# Altium schematic sheet Microcontroller_Module.SchDoc
size A2; SheetNumber: 1; SheetTotal: 3
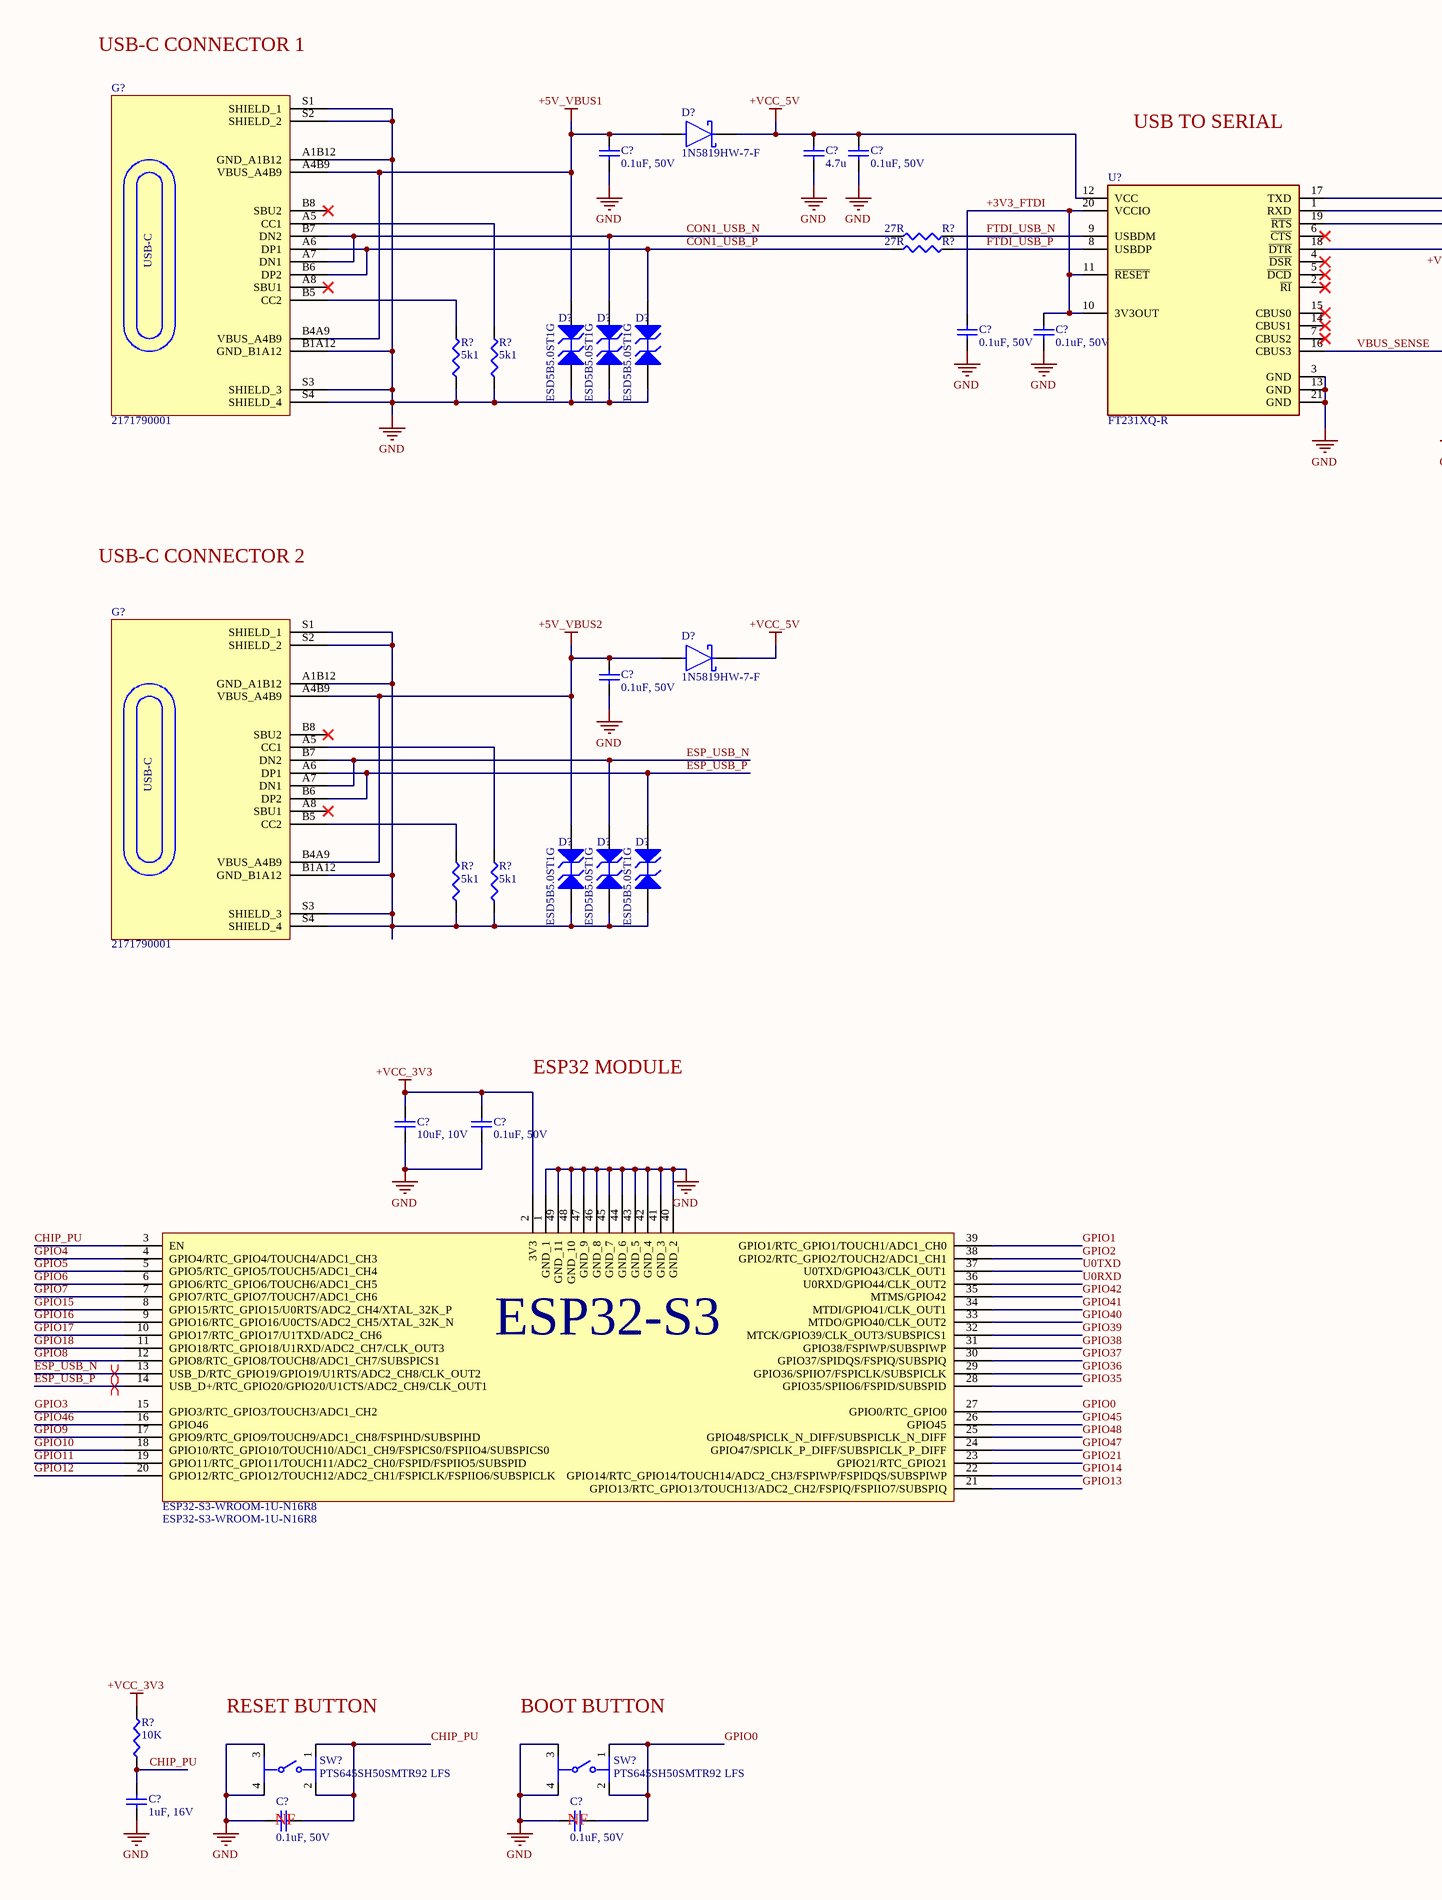
[diagram p0: Microcontroller_Module.SchDoc, left]
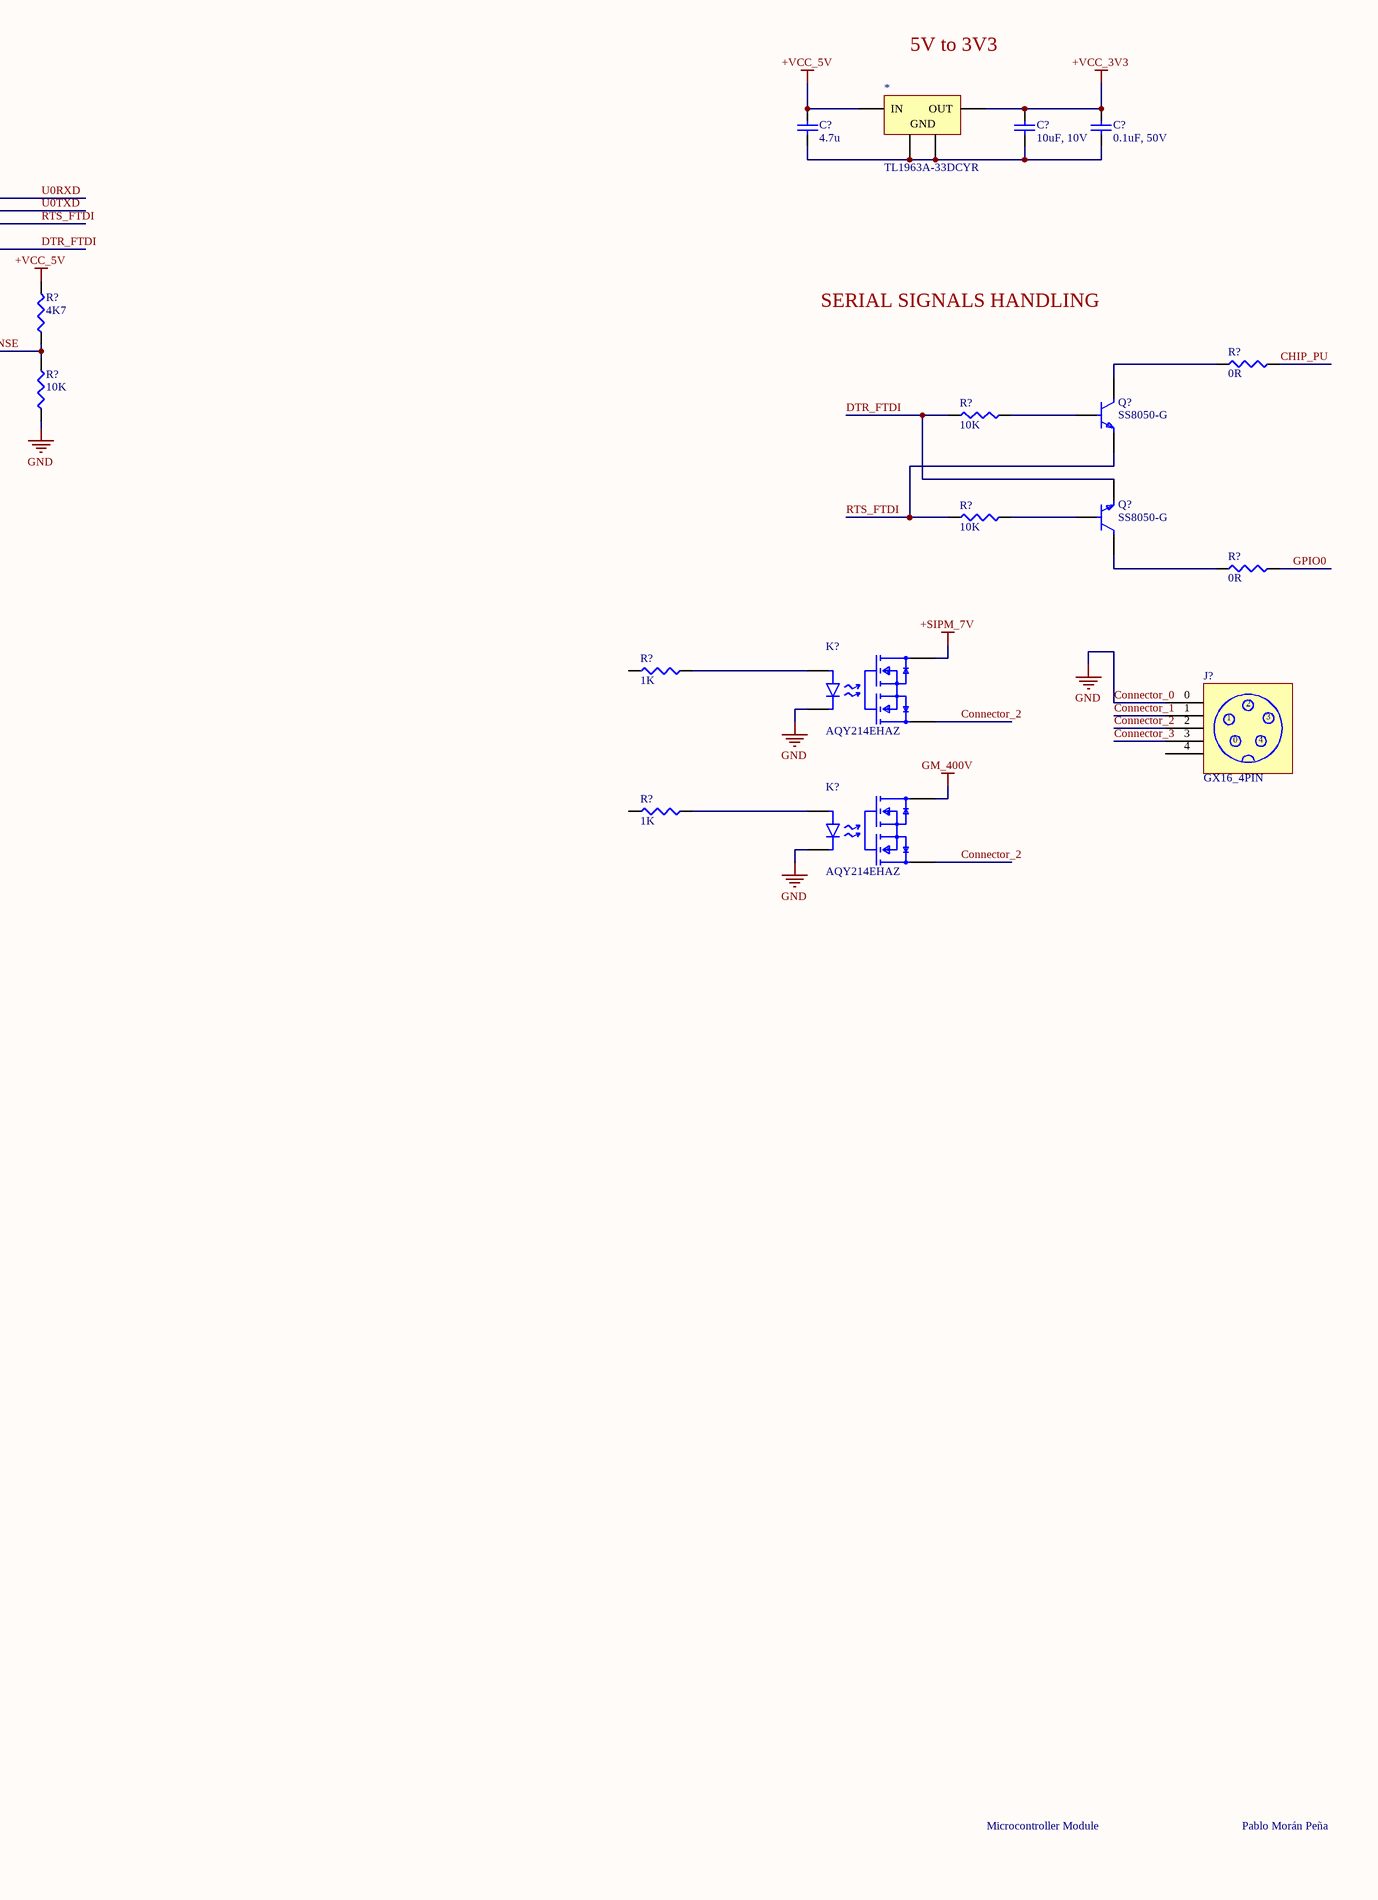
[diagram p1: Microcontroller_Module.SchDoc, right]

## Parts
(Parts that share a designator on the sheet are numbered #1, #2 ... from top to bottom, then left to right.)
*  TL1963A-33DCYR
C?#1  4.7u
C?#2  10uF, 10V
C?#3  0.1uF, 50V
C?#4  0.1uF, 50V
C?#5  4.7u
C?#6  0.1uF, 50V
C?#7  0.1uF, 50V
C?#8  0.1uF, 50V
C?#9  0.1uF, 50V
C?#10  10uF, 10V
C?#11  0.1uF, 50V
C?#12  1uF, 16V
C?#13  0.1uF, 50V
C?#14  0.1uF, 50V
D?#1  1N5819HW-7-F
D?#2  ESD5B5.0ST1G
D?#3  ESD5B5.0ST1G
D?#4  ESD5B5.0ST1G
D?#5  1N5819HW-7-F
D?#6  ESD5B5.0ST1G
D?#7  ESD5B5.0ST1G
D?#8  ESD5B5.0ST1G
ESP32-S3-WROOM-1U-N16R8  ESP32-S3-WROOM-1U-N16R8
G?#1  2171790001
G?#2  2171790001
J?  GX16_4PIN
K?#1  AQY214EHAZ
K?#2  AQY214EHAZ
Q?#1  SS8050-G
Q?#2  SS8050-G
R?#1  27R
R?#2  27R
R?#3  4K7
R?#4  0R
R?#5  5k1
R?#6  5k1
R?#7  10K
R?#8  10K
R?#9  10K
R?#10  0R
R?#11  1K
R?#12  1K
R?#13  5k1
R?#14  5k1
R?#15  10K
SW?#1  PTS645SH50SMTR92 LFS
SW?#2  PTS645SH50SMTR92 LFS
U?  FT231XQ-R

## Nets
+5V_VBUS1: C?#4.2 D?#1.2(A) D?#2.2(A2) G?#1.A4B9(VBUS_A4B9) G?#1.B4A9(VBUS_A4B9)
+5V_VBUS2: C?#9.2 D?#5.2(A) D?#6.2(A2) G?#2.A4B9(VBUS_A4B9) G?#2.B4A9(VBUS_A4B9)
+SIPM_7V: K?#1.4(2_DRAIN)
+VCC_3V3: *.3(OUT) C?#2.2 C?#3.2 C?#10.2 C?#11.2 ESP32-S3-WROOM-1U-N16R8.2(3V3) R?#15.2
+VCC_5V: *.1(IN) C?#1.2 C?#5.2 C?#6.2 D?#1.1(C) D?#5.1(C) R?#3.2 U?.12(VCC)
Connector_0: C?#4.1 C?#5.1 C?#6.1 C?#7.1 C?#8.1 C?#9.1 C?#10.1 C?#11.1 C?#12.1 C?#13.1 C?#14.1 D?#2.1(A1) D?#3.1(A1) D?#4.1(A1) ESP32-S3-WROOM-1U-N16R8.1(GND_1) ESP32-S3-WROOM-1U-N16R8.40(GND_2) ESP32-S3-WROOM-1U-N16R8.41(GND_3) ESP32-S3-WROOM-1U-N16R8.42(GND_4) ESP32-S3-WROOM-1U-N16R8.43(GND_5) ESP32-S3-WROOM-1U-N16R8.44(GND_6) ESP32-S3-WROOM-1U-N16R8.45(GND_7) ESP32-S3-WROOM-1U-N16R8.46(GND_8) ESP32-S3-WROOM-1U-N16R8.47(GND_9) ESP32-S3-WROOM-1U-N16R8.48(GND_10) ESP32-S3-WROOM-1U-N16R8.49(GND_11) G?#1.A1B12(GND_A1B12) G?#1.B1A12(GND_B1A12) G?#1.S1(SHIELD_1) G?#1.S2(SHIELD_2) G?#1.S3(SHIELD_3) G?#1.S4(SHIELD_4) J?.0 K?#1.2(C) K?#2.2(C) R?#5.1 R?#6.1 R?#8.1 SW?#1.3 SW?#1.4 SW?#2.3 SW?#2.4 U?.3(GND) U?.13(GND) U?.21(GND)  [also labelled GND]
GM_400V: K?#2.4(2_DRAIN)
+3V3_FTDI: C?#7.2 C?#8.2 U?.10(3V3OUT) U?.11(~{RESET}) U?.20(VCCIO)
CHIP_PU: C?#12.2 C?#13.2 ESP32-S3-WROOM-1U-N16R8.3(EN) R?#4.2 R?#15.1 SW?#1.1 SW?#1.2
CON1_USB_N: D?#3.2(A2) G?#1.A7(DN1) G?#1.B7(DN2) R?#1.1
CON1_USB_P: D?#4.2(A2) G?#1.A6(DP1) G?#1.B6(DP2) R?#2.1
Connector_1: J?.1
Connector_2: J?.2 K?#1.3(1_DRAIN) K?#2.3(1_DRAIN)
Connector_3: J?.3
DTR_FTDI: Q?#2.2(E) R?#7.1 U?.18(~{DTR})
ESP_USB_N: D?#7.2(A2) ESP32-S3-WROOM-1U-N16R8.13(USB_D/RTC_GPIO19/GPIO19/U1RTS/ADC2_CH8/CLK_OUT2) G?#2.A7(DN1) G?#2.B7(DN2)
ESP_USB_P: D?#8.2(A2) ESP32-S3-WROOM-1U-N16R8.14(USB_D+/RTC_GPIO20/GPIO20/U1CTS/ADC2_CH9/CLK_OUT1) G?#2.A6(DP1) G?#2.B6(DP2)
FTDI_USB_N: R?#1.2 U?.9(USBDM)
FTDI_USB_P: R?#2.2 U?.8(USBDP)
GPIO0: C?#14.2 ESP32-S3-WROOM-1U-N16R8.27(GPIO0/RTC_GPIO0) R?#10.2 SW?#2.1 SW?#2.2
GPIO1: ESP32-S3-WROOM-1U-N16R8.39(GPIO1/RTC_GPIO1/TOUCH1/ADC1_CH0)
GPIO2: ESP32-S3-WROOM-1U-N16R8.38(GPIO2/RTC_GPIO2/TOUCH2/ADC1_CH1)
GPIO3: ESP32-S3-WROOM-1U-N16R8.15(GPIO3/RTC_GPIO3/TOUCH3/ADC1_CH2)
GPIO4: ESP32-S3-WROOM-1U-N16R8.4(GPIO4/RTC_GPIO4/TOUCH4/ADC1_CH3)
GPIO5: ESP32-S3-WROOM-1U-N16R8.5(GPIO5/RTC_GPIO5/TOUCH5/ADC1_CH4)
GPIO6: ESP32-S3-WROOM-1U-N16R8.6(GPIO6/RTC_GPIO6/TOUCH6/ADC1_CH5)
GPIO7: ESP32-S3-WROOM-1U-N16R8.7(GPIO7/RTC_GPIO7/TOUCH7/ADC1_CH6)
GPIO8: ESP32-S3-WROOM-1U-N16R8.12(GPIO8/RTC_GPIO8/TOUCH8/ADC1_CH7/SUBSPICS1)
GPIO9: ESP32-S3-WROOM-1U-N16R8.17(GPIO9/RTC_GPIO9/TOUCH9/ADC1_CH8/FSPIHD/SUBSPIHD)
GPIO10: ESP32-S3-WROOM-1U-N16R8.18(GPIO10/RTC_GPIO10/TOUCH10/ADC1_CH9/FSPICS0/FSPIIO4/SUBSPICS0)
GPIO11: ESP32-S3-WROOM-1U-N16R8.19(GPIO11/RTC_GPIO11/TOUCH11/ADC2_CH0/FSPID/FSPIIO5/SUBSPID)
GPIO12: ESP32-S3-WROOM-1U-N16R8.20(GPIO12/RTC_GPIO12/TOUCH12/ADC2_CH1/FSPICLK/FSPIIO6/SUBSPICLK)
GPIO13: ESP32-S3-WROOM-1U-N16R8.21(GPIO13/RTC_GPIO13/TOUCH13/ADC2_CH2/FSPIQ/FSPIIO7/SUBSPIQ)
GPIO14: ESP32-S3-WROOM-1U-N16R8.22(GPIO14/RTC_GPIO14/TOUCH14/ADC2_CH3/FSPIWP/FSPIDQS/SUBSPIWP)
GPIO15: ESP32-S3-WROOM-1U-N16R8.8(GPIO15/RTC_GPIO15/U0RTS/ADC2_CH4/XTAL_32K_P)
GPIO16: ESP32-S3-WROOM-1U-N16R8.9(GPIO16/RTC_GPIO16/U0CTS/ADC2_CH5/XTAL_32K_N)
GPIO17: ESP32-S3-WROOM-1U-N16R8.10(GPIO17/RTC_GPIO17/U1TXD/ADC2_CH6)
GPIO18: ESP32-S3-WROOM-1U-N16R8.11(GPIO18/RTC_GPIO18/U1RXD/ADC2_CH7/CLK_OUT3)
GPIO21: ESP32-S3-WROOM-1U-N16R8.23(GPIO21/RTC_GPIO21)
GPIO35: ESP32-S3-WROOM-1U-N16R8.28(GPIO35/SPIIO6/FSPID/SUBSPID)
GPIO36: ESP32-S3-WROOM-1U-N16R8.29(GPIO36/SPIIO7/FSPICLK/SUBSPICLK)
GPIO37: ESP32-S3-WROOM-1U-N16R8.30(GPIO37/SPIDQS/FSPIQ/SUBSPIQ)
GPIO38: ESP32-S3-WROOM-1U-N16R8.31(GPIO38/FSPIWP/SUBSPIWP)
GPIO39: ESP32-S3-WROOM-1U-N16R8.32(MTCK/GPIO39/CLK_OUT3/SUBSPICS1)
GPIO40: ESP32-S3-WROOM-1U-N16R8.33(MTDO/GPIO40/CLK_OUT2)
GPIO41: ESP32-S3-WROOM-1U-N16R8.34(MTDI/GPIO41/CLK_OUT1)
GPIO42: ESP32-S3-WROOM-1U-N16R8.35(MTMS/GPIO42)
GPIO45: ESP32-S3-WROOM-1U-N16R8.26(GPIO45)
GPIO46: ESP32-S3-WROOM-1U-N16R8.16(GPIO46)
GPIO47: ESP32-S3-WROOM-1U-N16R8.24(GPIO47/SPICLK_P_DIFF/SUBSPICLK_P_DIFF)
GPIO48: ESP32-S3-WROOM-1U-N16R8.25(GPIO48/SPICLK_N_DIFF/SUBSPICLK_N_DIFF)
RTS_FTDI: Q?#1.2(E) R?#9.1 U?.19(~{RTS})
U0RXD: ESP32-S3-WROOM-1U-N16R8.36(U0RXD/GPIO44/CLK_OUT2) U?.17(TXD)
U0TXD: ESP32-S3-WROOM-1U-N16R8.37(U0TXD/GPIO43/CLK_OUT1) U?.1(RXD)
VBUS_SENSE: R?#3.1 R?#8.2 U?.16(CBUS3)
Net*_2: *.2(GND) *.4(GND) C?#1.1 C?#2.1 C?#3.1
NetD?#6_1: D?#6.1(A1) D?#7.1(A1) D?#8.1(A1) G?#2.A1B12(GND_A1B12) G?#2.B1A12(GND_B1A12) G?#2.S1(SHIELD_1) G?#2.S2(SHIELD_2) G?#2.S3(SHIELD_3) G?#2.S4(SHIELD_4) R?#13.1 R?#14.1
NetG?#1_A5: G?#1.A5(CC1) R?#6.2
NetG?#1_B5: G?#1.B5(CC2) R?#5.2
NetG?#2_A5: G?#2.A5(CC1) R?#14.2
NetG?#2_B5: G?#2.B5(CC2) R?#13.2
NetK?#1_1: K?#1.1(A) R?#11.2
NetK?#2_1: K?#2.1(A) R?#12.2
NetQ?#1_1: Q?#1.1(B) R?#7.2
NetQ?#1_3: Q?#1.3(C) R?#4.1
NetQ?#2_1: Q?#2.1(B) R?#9.2
NetQ?#2_3: Q?#2.3(C) R?#10.1

Not connected (* = marked no-connect by the designer): G?#1 A8(SBU1)* B8(SBU2)*; G?#2 A8(SBU1)* B8(SBU2)*; J? 4; R?#11 1; R?#12 1; U? 2(~{RI})* 4(~{DSR})* 5(~{DCD})* 6(~{CTS})* 7(CBUS2)* 14(CBUS1)* 15(CBUS0)*

## Layout directives
differential pair; differential pair class DIFF90: ESP_USB_N, ESP_USB_P

## Notes on the sheet
- USB-C CONNECTOR 1
- 5V to 3V3
- USB TO SERIAL
- SERIAL SIGNALS HANDLING
- USB-C CONNECTOR 2
- ESP32 MODULE
- RESET BUTTON
- BOOT BUTTON
- (near C?#13) NF
- (near C?#14) NF
- Microcontroller Module
- Pablo Morán Peña
- (in symbol 217179-0001) USB-C
- (in symbol ESP32-S3-WROOM-1U-N16R8) ESP32-S3

## Library data of the parts
* = TL1963A-33DCYR: IC REG LIN 3.3V 1.5A SOT-223-4; Manufacturer: Texas Instruments; Package Body Material: Plastic; Adjustability: FIXED; Dropout Voltage1-Max: 550mV; Dropout Voltage1-Nom: 340mV; Input Voltage Absolute-Max: 20V; Min Input Voltage: 3.8V; Channels: 1; Output Voltage1-Max: 3.4V; Output Voltage1-Min: 3.2V; Regulator Type: FIXED POSITIVE SINGLE OUTPUT LDO REGULATOR; Voltage Tolerance-Max: 3%; Qualification Status: Not Qualified; Supplier: Digikey; Supplier Part Number: 296-24897-1-ND; Manufacturer Part Number: TL1963A-33DCYR; RoHS: Yes; Category: Voltage Regulators - Linear; Stock: 2575; Pricing: 1=2,77, 10=2,069, 25=1,8936, 100=1,7, 250=1,60772, 500=1,55212, 1000=1,50634 (USD); Case/Package: SOP; Pins: 4; Package Shape: Rectangular; Terminal Finish: Tin; JESD-609 Code: e3; Max Supply Voltage: 20V; JESD-30 Code: R-PDSO-G4; Moisture Sensitivity Level: 2; Number of Outputs: 1; Operating Temperature, TJ-Max: 125°C; Operating Temperature, TJ-Min: -40°C; Output Current1-Max: 1.5A; Output Voltage1-Nom: 3.3V; Packaging: Tape and Reel; Peak Reflow Temperature (Cel): 260°C; Surface Mount: Yes; Technology: BIPOLAR; Terminal Form: Gull Wing; Terminal Position: DUAL; Length: 6.5mm; Width: 3.5mm; Height - Seated (Max): 1.8mm; Terminal Pitch: 2.3mm; Reach SVHC Compliant: Yes; RoHS Compliant: Yes; ComponentLink1URL: https://www.ti.com:443/lit/ds/symlink/tl1963a.pdf?src-supplier=IHS+Markit; ComponentLink1Description: https://www.ti.com:443/lit/ds/symlink/tl1963a.pdf?src-supplier=IHS+Markit; ComponentLink2URL: https://datasheet.ciiva.com/2046/-2046068.pdf?src-supplier=Digikey; ComponentLink2Description: https://datasheet.ciiva.com/2046/-2046068.pdf?src-supplier=Digikey
C?#1 C?#5 = CL05A475KQ5NRNC: CAP CER 4.7UF 6.3V X5R 0402; Manufacturer: Samsung; Dielectric Material: Ceramic; Multilayer: Yes; Tolerance  (fill in as +-): 10%; Supplier: Digikey; Supplier Part Number: 1276-1481-1-ND; Manufacturer Part Number: CL05A475KQ5NRNC; RoHS: Yes; Category: Ceramic Capacitors; Stock: 1369367; Pricing: 1=0,08, 10=0,023, 100=0,016, 1000=0,0112, 2500=0,0096 (USD); Mounting Technology: Surface Mount; Pins: 2; Package Shape: Rectangular; Case/Package: 0402; Terminal Finish: Nickel; Min Operating Temperature: -55°C; Max Operating Temperature: 85°C; JESD-609 Code: e3; Value: 4.7uF; Capacitor Type: Ceramic; Packaging: Tape and Reel; Tolerance (fill in as +-): 10%; Rated DC Voltage (URdc): 6.3V; Temperature Characteristics Code: X5R; Termination: Wraparound; Reach SVHC Compliant: Yes; RoHS Compliant: Yes; ComponentLink1URL: https://datasheet.ciiva.com:443/pdfs/VipMasterIC/IC/SEMS/SEMS-S-A0008521219/SEMS-S-A0008521124-1.pdf?src-supplier=IHS+Markit; ComponentLink1Description: https://datasheet.ciiva.com:443/pdfs/VipMasterIC/IC/SEMS/SEMS-S-A0008521219/SEMS-S-A0008521124-1.pdf?src-supplier=IHS+Markit; ComponentLink2URL: https://datasheet.ciiva.com/25793/cl05a475kq5nrnc-25793634.pdf?src-supplier=Digikey; ComponentLink2Description: https://datasheet.ciiva.com/25793/cl05a475kq5nrnc-25793634.pdf?src-supplier=Digikey; LCSC Part Number: *
C?#2 C?#10 = CL05A106MP8NUB8: CAP CER 10UF 10V X5R 0402; Manufacturer: Samsung Electro-Mechanics; Dielectric Material: Ceramic; Multilayer: Yes; Tolerance  (fill in as +-): 20%; Supplier: Digikey; Supplier Part Number: 1276-6830-1-ND; Manufacturer Part Number: CL05A106MP8NUB8; Category: Ceramic Capacitors; Stock: 145439; Pricing: 1=0,2, 10=0,12, 100=0,0808, 1000=0,0568 (USD); Mounting Technology: Surface Mount; Pins: 2; Package Shape: Rectangular; Case/Package: 0402; Terminal Finish: Nickel; Min Operating Temperature: -55°C; Max Operating Temperature: 85°C; JESD-609 Code: e3; Value: 10uF; Capacitor Type: Ceramic; Packaging: Tape and Reel; Tolerance (fill in as +-): 20%; Rated DC Voltage (URdc): 10V; Temperature Characteristics Code: X5R; Termination: Wraparound; Reach SVHC Compliant: Yes; RoHS Compliant: Yes; ComponentLink1URL: https://datasheet.ciiva.com:443/pdfs/VipMasterIC/IC/SEMS/SEMS-S-A0008521219/SEMS-S-A0008521325-1.pdf?src-supplier=IHS+Markit; ComponentLink1Description: https://datasheet.ciiva.com:443/pdfs/VipMasterIC/IC/SEMS/SEMS-S-A0008521219/SEMS-S-A0008521325-1.pdf?src-supplier=IHS+Markit; ComponentLink2URL: https://datasheet.octopart.com/CL05A106MP8NUB8-Samsung-Electro-Mechanics-datasheet-181551178.pdf?src-supplier=Farnell; ComponentLink2Description: https://datasheet.octopart.com/CL05A106MP8NUB8-Samsung-Electro-Mechanics-datasheet-181551178.pdf?src-supplier=Farnell; ComponentLink3URL: https://datasheet.octopart.com/CL05A106MP8NUB8-Samsung-Electro-Mechanics-datasheet-141346815.pdf?src-supplier=Samsung+SCT; ComponentLink3Description: https://datasheet.octopart.com/CL05A106MP8NUB8-Samsung-Electro-Mechanics-datasheet-141346815.pdf?src-supplier=Samsung+SCT; ComponentLink4URL: https://datasheet.octopart.com/CL05A106MP8NUB8-Samsung-Electro-Mechanics-datasheet-136460857.pdf?src-supplier=Future+Electronics; ComponentLink4Description: https://datasheet.octopart.com/CL05A106MP8NUB8-Samsung-Electro-Mechanics-datasheet-136460857.pdf?src-supplier=Future+Electronics; ComponentLink5URL: https://datasheet.octopart.com/CL05A106MP8NUB8-Samsung-Electro-Mechanics-datasheet-110326781.pdf?src-supplier=Future+Electronics; ComponentLink5Description: https://datasheet.octopart.com/CL05A106MP8NUB8-Samsung-Electro-Mechanics-datasheet-110326781.pdf?src-supplier=Future+Electronics; ComponentLink6URL: https://datasheet.octopart.com/CL05A106MP8NUB8-Samsung-Electro-Mechanics-datasheet-96443587.pdf?src-supplier=Future+Electronics; ComponentLink6Description: https://datasheet.octopart.com/CL05A106MP8NUB8-Samsung-Electro-Mechanics-datasheet-96443587.pdf?src-supplier=Future+Electronics; ComponentLink7URL: https://datasheet.octopart.com/CL05A106MP8NUB8-Samsung-Electro-Mechanics-datasheet-68297032.pdf?src-supplier=Future+Electronics; ComponentLink7Description: https://datasheet.octopart.com/CL05A106MP8NUB8-Samsung-Electro-Mechanics-datasheet-68297032.pdf?src-supplier=Future+Electronics; ComponentLink8URL: https://datasheet.octopart.com/CL05A106MP8NUB8-Samsung-Electro-Mechanics-datasheet-86032222.pdf?src-supplier=Future+Electronics; ComponentLink8Description: https://datasheet.octopart.com/CL05A106MP8NUB8-Samsung-Electro-Mechanics-datasheet-86032222.pdf?src-supplier=Future+Electronics; LCSC Part Number: C307415
C?#3 C?#4 C?#6-C?#9 C?#11 C?#13 C?#14 = CL05B104KB5NNNC: CAP CER 0.1UF 50V X7R 0402; Manufacturer: Samsung; Dielectric Material: Ceramic; Value: 100nF; Multilayer: Yes; Tolerance  (fill in as +-): 10%; Supplier: Avnet; Supplier Part Number: CL05B104KB5NNNC; Manufacturer Part Number: CL05B104KB5NNNC; RoHS: Yes; Category: Ceramic Capacitors; Pricing: 100000=0,00598, 120000=0,00595, 220000=0,00592, 500000=0,00589, 1000000=0,00586 (USD); Mounting Technology: Surface Mount; Pins: 2; Package Shape: Rectangular; Case/Package: 0402; Terminal Finish: Nickel; Min Operating Temperature: -55°C; Max Operating Temperature: 125°C; JESD-609 Code: e3; Capacitor Type: Ceramic; Packaging: Tape and Reel; Tolerance (fill in as +-): 10%; Rated DC Voltage (URdc): 50V; Temperature Characteristics Code: X7R; Termination: Wraparound; Reach SVHC Compliant: Yes; RoHS Compliant: Yes; ComponentLink1URL: https://datasheet.ciiva.com:443/pdfs/VipMasterIC/IC/SEMS/SEMS-S-A0008523115/SEMS-S-A0008523176-1.pdf?src-supplier=IHS+Markit; ComponentLink1Description: https://datasheet.ciiva.com:443/pdfs/VipMasterIC/IC/SEMS/SEMS-S-A0008523115/SEMS-S-A0008523176-1.pdf?src-supplier=IHS+Markit; ComponentLink2URL: https://datasheet.octopart.com/CL05B104KB5NNNC-Samsung-datasheet-97040617.pdf?src-supplier=Future+Electronics; ComponentLink2Description: https://datasheet.octopart.com/CL05B104KB5NNNC-Samsung-datasheet-97040617.pdf?src-supplier=Future+Electronics; ComponentLink3URL: https://datasheet.octopart.com/CL05B104KB5NNNC-Samsung-datasheet-8326407.pdf?src-supplier=TME; ComponentLink3Description: https://datasheet.octopart.com/CL05B104KB5NNNC-Samsung-datasheet-8326407.pdf?src-supplier=TME; LCSC Part Number: C960916
C?#12 = CL05A105KO5NNNC: CAP CER 1UF 16V X5R 0402; Manufacturer: Samsung Electro-Mechanics; Dielectric Material: Ceramic; Multilayer: Yes; Tolerance  (fill in as +-): 10%; Supplier: Digikey; Supplier Part Number: 1276-1067-1-ND; Manufacturer Part Number: CL05A105KO5NNNC; Category: Ceramic Capacitors; Stock: 655135; Pricing: 1=0,08, 10=0,014, 100=0,0104, 1000=0,0072, 2500=0,0064 (USD); Mounting Technology: Surface Mount; Pins: 2; Package Shape: Rectangular; Case/Package: 0402; Terminal Finish: Nickel; Min Operating Temperature: -55°C; Max Operating Temperature: 85°C; JESD-609 Code: e3; Value: 1uF; Capacitor Type: Ceramic; Package Style: SMTMeter; Packaging: Tape and Reel; Tolerance (fill in as +-): 10%; Rated DC Voltage (URdc): 16V; Temperature Characteristics Code: X5R; Termination: Wraparound; Length: 1mm; Width: 0.5mm; Height: 0.55mm; Reach SVHC Compliant: Yes; RoHS Compliant: Yes; ComponentLink1URL: https://datasheet.ciiva.com:443/pdfs/VipMasterIC/IC/SEMS/SEMS-S-A0008384515/SEMS-S-A0008892675-1.pdf?src-supplier=IHS+Markit; ComponentLink1Description: https://datasheet.ciiva.com:443/pdfs/VipMasterIC/IC/SEMS/SEMS-S-A0008384515/SEMS-S-A0008892675-1.pdf?src-supplier=IHS+Markit; ComponentLink2URL: https://datasheet.octopart.com/CL05A105KO5NNNC-Samsung-Electro-Mechanics-datasheet-181960514.pdf?src-supplier=Farnell; ComponentLink2Description: https://datasheet.octopart.com/CL05A105KO5NNNC-Samsung-Electro-Mechanics-datasheet-181960514.pdf?src-supplier=Farnell; ComponentLink3URL: https://datasheet.octopart.com/CL05A105KO5NNNC-Samsung-Electro-Mechanics-datasheet-136031720.pdf?src-supplier=Samsung+SCT; ComponentLink3Description: https://datasheet.octopart.com/CL05A105KO5NNNC-Samsung-Electro-Mechanics-datasheet-136031720.pdf?src-supplier=Samsung+SCT; ComponentLink4URL: https://datasheet.octopart.com/CL05A105KO5NNNC-Samsung-Electro-Mechanics-datasheet-110226202.pdf?src-supplier=Future+Electronics; ComponentLink4Description: https://datasheet.octopart.com/CL05A105KO5NNNC-Samsung-Electro-Mechanics-datasheet-110226202.pdf?src-supplier=Future+Electronics; ComponentLink5URL: https://datasheet.octopart.com/CL05A105KO5NNNC-Samsung-Electro-Mechanics-datasheet-81461590.pdf?src-supplier=Future+Electronics; ComponentLink5Description: https://datasheet.octopart.com/CL05A105KO5NNNC-Samsung-Electro-Mechanics-datasheet-81461590.pdf?src-supplier=Future+Electronics; ComponentLink6URL: https://datasheet.octopart.com/CL05A105KO5NNNC-Samsung-Electro-Mechanics-datasheet-149136633.pdf?src-supplier=Future+Electronics; ComponentLink6Description: https://datasheet.octopart.com/CL05A105KO5NNNC-Samsung-Electro-Mechanics-datasheet-149136633.pdf?src-supplier=Future+Electronics; ComponentLink7URL: https://datasheet.octopart.com/CL05A105KO5NNNC-Samsung-Electro-Mechanics-datasheet-97040617.pdf; ComponentLink7Description: https://datasheet.octopart.com/CL05A105KO5NNNC-Samsung-Electro-Mechanics-datasheet-97040617.pdf; ComponentLink8URL: https://datasheet.octopart.com/CL05A105KO5NNNC-Samsung-Electro-Mechanics-datasheet-8324245.pdf; ComponentLink8Description: https://datasheet.octopart.com/CL05A105KO5NNNC-Samsung-Electro-Mechanics-datasheet-8324245.pdf; ComponentLink9URL: https://datasheet.octopart.com/General-Multilayer-Ceramic-Capacitors-Samsung-datasheet-family-111.pdf; ComponentLink9Description: https://datasheet.octopart.com/General-Multilayer-Ceramic-Capacitors-Samsung-datasheet-family-111.pdf; ComponentLink10URL: https://datasheet.octopart.com/CL05A105KO5NNNC-Samsung-Electro-Mechanics-datasheet-11776774.pdf?src-supplier=Arrow+Electronics; ComponentLink10Description: https://datasheet.octopart.com/CL05A105KO5NNNC-Samsung-Electro-Mechanics-datasheet-11776774.pdf?src-supplier=Arrow+Electronics; ComponentLink11URL: https://datasheet.octopart.com/CL05A105KO5NNNC-Samsung-datasheet-97040617.pdf; ComponentLink11Description: https://datasheet.octopart.com/CL05A105KO5NNNC-Samsung-datasheet-97040617.pdf; ComponentLink12URL: https://datasheet.octopart.com/CL05A105KO5NNNC-Samsung-datasheet-8324245.pdf; ComponentLink12Description: https://datasheet.octopart.com/CL05A105KO5NNNC-Samsung-datasheet-8324245.pdf; ComponentLink13URL: https://datasheet.octopart.com/CL05A105KO5NNNC-Samsung-datasheet-42280519.pdf?src-supplier=Future+Electronics; ComponentLink13Description: https://datasheet.octopart.com/CL05A105KO5NNNC-Samsung-datasheet-42280519.pdf?src-supplier=Future+Electronics; ComponentLink14URL: https://datasheet.octopart.com/CL05A105KO5NNNC-Samsung-datasheet-34152987.pdf?src-supplier=Future+Electronics; ComponentLink14Description: https://datasheet.octopart.com/CL05A105KO5NNNC-Samsung-datasheet-34152987.pdf?src-supplier=Future+Electronics; ComponentLink15URL: https://datasheet.octopart.com/CL05A105KO5NNNC-Samsung-datasheet-11776774.pdf?src-supplier=Future+Electronics; ComponentLink15Description: https://datasheet.octopart.com/CL05A105KO5NNNC-Samsung-datasheet-11776774.pdf?src-supplier=Future+Electronics; ComponentLink16URL: https://datasheet.octopart.com/CL05A105KO5NNNC-Samsung-datasheet-8329584.pdf?src-supplier=Future+Electronics; ComponentLink16Description: https://datasheet.octopart.com/CL05A105KO5NNNC-Samsung-datasheet-8329584.pdf?src-supplier=Future+Electronics; ComponentLink17URL: https://datasheet.octopart.com/CL05A105KO5NNNC-Samsung-datasheet-59220082.pdf?src-supplier=TME; ComponentLink17Description: https://datasheet.octopart.com/CL05A105KO5NNNC-Samsung-datasheet-59220082.pdf?src-supplier=TME; LCSC Part Number: C29266
D?#1 D?#5 = 1N5819HW-7-F: DIODE SCHOTTKY 40V 1A SOD123; Manufacturer: Diodes; Diode Element Material: SILICON; Package Body Material: Plastic; Diode Type: RECTIFIER; Number of Elements: 1; Max Power Dissipation: 450mW; Forward Voltage: 320mV; Non-rep Pk Forward Current-Max: 25A; Time @ Peak Reflow Temperature-Max (s): 40s; Qualification Status: Not Qualified; Supplier: Digikey; Supplier Part Number: 1N5819HW-FDICT-ND; Manufacturer Part Number: 1N5819HW-7-F; RoHS: Yes; Category: Schottky Diodes; Stock: 462387; Pricing: 1=0,25, 10=0,17, 100=0,1207, 500=0,10056, 1000=0,09006 (USD); Pins: 2; Package Shape: Rectangular; Terminal Finish: Tin; Min Operating Temperature: -65°C; Max Operating Temperature: 125°C; JESD-30 Code: R-PDSO-G2; Max Output current: 1A; Package Style: SMALL OUTLINEMeter; Rep Pk Reverse Voltage-Max: 40V; Surface Mount: Yes; Technology: SCHOTTKY; Terminal Form: Gull Wing; Terminal Position: DUAL; JESD-609 Code: e3; Moisture Sensitivity Level: 1; Peak Reflow Temperature (Cel): 260°C; Reach SVHC Compliant: Yes; RoHS Compliant: Yes; ComponentLink1URL: https://datasheet.ciiva.com:443/pdfs/VipMasterIC/IC/DIOD/DIOD-S-A0009689747/DIOD-S-A0009691035-1.pdf?src-supplier=IHS+Markit; ComponentLink1Description: https://datasheet.ciiva.com:443/pdfs/VipMasterIC/IC/DIOD/DIOD-S-A0009689747/DIOD-S-A0009691035-1.pdf?src-supplier=IHS+Markit; ComponentLink2URL: https://datasheet.ciiva.com/27092/1538419-27092484.pdf?src-supplier=Jameco; ComponentLink2Description: https://datasheet.ciiva.com/27092/1538419-27092484.pdf?src-supplier=Jameco; ComponentLink3URL: https://datasheet.ciiva.com/16303/ds30217-16303296.pdf?src-supplier=Future+Electronics; ComponentLink3Description: https://datasheet.ciiva.com/16303/ds30217-16303296.pdf?src-supplier=Future+Electronics; ComponentLink4URL: https://datasheet.ciiva.com/1177/ds30217-1177089.pdf?src-supplier=Element14; ComponentLink4Description: https://datasheet.ciiva.com/1177/ds30217-1177089.pdf?src-supplier=Element14; ComponentLink5URL: https://datasheet.ciiva.com/8303/ds30217-8303132.pdf?src-supplier=Avnet; ComponentLink5Description: https://datasheet.ciiva.com/8303/ds30217-8303132.pdf?src-supplier=Avnet; ComponentLink6URL: https://datasheet.ciiva.com/912/ds30217-912802.pdf?src-supplier=Digikey; ComponentLink6Description: https://datasheet.ciiva.com/912/ds30217-912802.pdf?src-supplier=Digikey; ComponentLink7URL: https://datasheet.ciiva.com/912/ds30217-912803.pdf?src-supplier=Digikey; ComponentLink7Description: https://datasheet.ciiva.com/912/ds30217-912803.pdf?src-supplier=Digikey; ComponentLink8URL: https://datasheet.ciiva.com/912/ds30217-912801.pdf?src-supplier=Digikey; ComponentLink8Description: https://datasheet.ciiva.com/912/ds30217-912801.pdf?src-supplier=Digikey; LCSC Part Number: C82544
D?#2-D?#4 D?#6-D?#8 = ESD5B5.0ST1G: TVS DIODE 5VWM SOD523; Manufacturer: ON Semiconductor; Diode Element Material: SILICON; Package Body Material: Plastic; Polarity: Bidirectional; Diode Type: TRANS VOLTAGE SUPPRESSOR; Number of Elements: 2; Max Power Dissipation: 200mW; Max Breakdown Voltage: 7.8V; Min Breakdown Voltage: 5.8V; Non-rep Peak Rev Power Dis-Max: 50W; Rep Pk Reverse Voltage-Max: 5V; Breakdown Voltage-Nom: 6.8V; Time @ Peak Reflow Temperature-Max (s): 40s; Qualification Status: Not Qualified; Supplier: Digikey; Supplier Part Number: ESD5B5.0ST1GOSCT-ND; Manufacturer Part Number: ESD5B5.0ST1G; RoHS: Yes; Category: ESD and Circuit Protection ICs; Stock: 174346; Pricing: 1=0,18, 10=0,098, 100=0,052, 500=0,051, 1000=0,05 (USD); Pins: 2; Package Shape: Rectangular; Terminal Finish: Tin; Min Operating Temperature: -55°C; Max Operating Temperature: 150°C; JESD-609 Code: e3; JESD-30 Code: R-PDSO-F2; Moisture Sensitivity Level: 1; Package Style: SMALL OUTLINEMeter; Surface Mount: Yes; Technology: AVALANCHE; Terminal Form: Flat; Terminal Position: DUAL; Peak Reflow Temperature (Cel): 260°C; Reach SVHC Compliant: Yes; RoHS Compliant: Yes; ComponentLink1URL: https://datasheet.ciiva.com:443/pdfs/VipMasterIC/IC/ONSM/ONSM-S-A0006115580/ONSM-S-A0006115580-1.pdf?src-supplier=IHS+Markit; ComponentLink1Description: https://datasheet.ciiva.com:443/pdfs/VipMasterIC/IC/ONSM/ONSM-S-A0006115580/ONSM-S-A0006115580-1.pdf?src-supplier=IHS+Markit; ComponentLink2URL: https://datasheet.ciiva.com/339/esd5b5-0st1g-339772.pdf?src-supplier=Avnet; ComponentLink2Description: https://datasheet.ciiva.com/339/esd5b5-0st1g-339772.pdf?src-supplier=Avnet; ComponentLink3URL: https://datasheet.ciiva.com/339/esd5b5-0st1g-339772.pdf?src-supplier=Digikey; ComponentLink3Description: https://datasheet.ciiva.com/339/esd5b5-0st1g-339772.pdf?src-supplier=Digikey; ComponentLink4URL: https://datasheet.ciiva.com/4510/esd5b5-0st1g-241623-4510548.pdf?src-supplier=Mouser; ComponentLink4Description: https://datasheet.ciiva.com/4510/esd5b5-0st1g-241623-4510548.pdf?src-supplier=Mouser; ComponentLink5URL: https://datasheet.ciiva.com/22637/716649-22637178.pdf?src-supplier=Element14; ComponentLink5Description: https://datasheet.ciiva.com/22637/716649-22637178.pdf?src-supplier=Element14; ComponentLink6URL: https://datasheet.ciiva.com/339/esd5b5-0st1-d-339773.pdf?src-supplier=Digikey; ComponentLink6Description: https://datasheet.ciiva.com/339/esd5b5-0st1-d-339773.pdf?src-supplier=Digikey; ComponentLink7URL: https://datasheet.ciiva.com/339/esd5b5-0st1-d-339774.pdf?src-supplier=Digikey; ComponentLink7Description: https://datasheet.ciiva.com/339/esd5b5-0st1-d-339774.pdf?src-supplier=Digikey; LCSC Part Number: C93623
ESP32-S3-WROOM-1U-N16R8 = ESP32-S3-WROOM-1U-N16R8: SMD Module, ESP32-S3R8 With 8 mb; Manufacturer: Espressif Systems; Supplier: Digikey; Supplier Part Number: 1965-ESP32-S3-WROOM-1U-N16R8CT-ND; Manufacturer Part Number: ESP32-S3-WROOM-1U-N16R8; RoHS: No; Category: LDO; Stock: 124; Pricing: 1=6,56, 10=5,683, 25=5,378, 100=4,9592, 250=4,7084 (USD); ComponentLink1URL: https://datasheet.octopart.com/ESP32-S3-WROOM-1U-N16R8-Espressif-Systems-datasheet-165560563.pdf?src-supplier=TME; ComponentLink1Description: https://datasheet.octopart.com/ESP32-S3-WROOM-1U-N16R8-Espressif-Systems-datasheet-165560563.pdf?src-supplier=TME; LCSC Part Number: C2913202
G?#1 G?#2 = 217179-0001: CONN RCP USB2.0 TYP C 24P SMD RA; Manufacturer: Molex; Supplier: Digikey; Supplier Part Number: 900-2171790001CT-ND; Manufacturer Part Number: 217179-0001; RoHS: No; Category: Connectors; Stock: 19206; Pricing: 1=0,83, 10=0,704, 25=0,6596, 50=0,628, 100=0,598, 250=0,56052, 500=0,53374 (USD); LCSC Part Number: C3197684
K?#1 K?#2 = AQY214EHAZ: SSR RELAY SPST-NO 120MA 0-400V; Manufacturer: Panasonic; Forward Current: 50mA; Input Type: DC; Isolation Voltage-Max: 5kV; Number of Elements: 1; On-state Resistance-Max: 35R; Optoelectronic Device Type: TRANSISTOR OUTPUT SSR; Output Circuit Type: MOSFET; Overall Height: 2.9mm; Supplier: Digikey; Supplier Part Number: 255-AQY214EHAZCT-ND; Manufacturer Part Number: AQY214EHAZ; RoHS: Yes; Category: Solid State Relays; Stock: 2139; Pricing: 1=2, 10=1,78, 25=1,7, 50=1,642, 100=1,5857, 250=1,51428, 500=1,46234 (USD); Terminal Finish: Tin; Min Operating Temperature: -40°C; Max Operating Temperature: 85°C; JESD-609 Code: e3; On-State Current-Max: 120mA; Length: 4.78mm; Reach SVHC Compliant: Yes; RoHS Compliant: Yes; ComponentLink1URL: https://datasheet.ciiva.com:443/pdfs/VipMasterIC/IC/PANA/PANA-S-A0003497442/PANA-S-A0003497442-1.pdf?src-supplier=IHS+Markit; ComponentLink1Description: https://datasheet.ciiva.com:443/pdfs/VipMasterIC/IC/PANA/PANA-S-A0003497442/PANA-S-A0003497442-1.pdf?src-supplier=IHS+Markit; ComponentLink2URL: https://datasheet.ciiva.com/32417/1159euen-1111-s-32417950.pdf?src-supplier=Distrelec; ComponentLink2Description: https://datasheet.ciiva.com/32417/1159euen-1111-s-32417950.pdf?src-supplier=Distrelec; LCSC Part Number: C371971
Q?#1 Q?#2 = SS8050-G: Transistores - Bipolar (BJT) - Simple NPN 25 V 1.5 A 100MHz 300 mW Montaje en superficie SOT-23-3; Manufacturer: Comchip; Supplier: Digikey; Supplier Part Number: 641-1790-1-ND; Manufacturer Part Number: SS8050-G; RoHS: Yes; Category: Transistors; Stock: 131317; Pricing: 1=0,24, 10=0,148, 100=0,0921, 500=0,06754, 1000=0,05958 (USD); Reach SVHC Compliant: Yes; RoHS Compliant: Yes; ComponentLink1URL: https://datasheet.ciiva.com:443/pdfs/VipMasterIC/IC/COMC/COMC-S-A0004994192/COMC-S-A0004994192-1.pdf?src-supplier=IHS+Markit; ComponentLink1Description: https://datasheet.ciiva.com:443/pdfs/VipMasterIC/IC/COMC/COMC-S-A0004994192/COMC-S-A0004994192-1.pdf?src-supplier=IHS+Markit; ComponentLink2URL: http://www.comchiptech.com/admin/files/product/SS8050-G RevA181526.pdf?src-supplier=Digikey; ComponentLink2Description: http://www.comchiptech.com/admin/files/product/SS8050-G RevA181526.pdf?src-supplier=Digikey; LCSC Part Number: C164886
R?#1 R?#2 = AC0402FR-0727RL: RES SMD 27 OHM 1% 1/16W 0402; Manufacturer: Yageo; Additional Feature: LASER TRIMMABLE; Power: 62.5mW; Rated Temperature: 70°C; Working Voltage: 50V; Temperature Coefficient (ppm/Cel): 100; Package Height: 0.32mm; Package Length: 1mm; Package Width: 0.5mm; Reference Standard: AEC-Q200; Supplier: Digikey; Supplier Part Number: YAG5278CT-ND; Manufacturer Part Number: AC0402FR-0727RL; RoHS: Yes; Category: Chip SMD Resistors; Stock: 4685; Pricing: 1=0,1, 10=0,01, 100=0,0071, 1000=0,00612, 2500=0,0051, 5000=0,00407 (USD); Mounting Technology: Surface Mount; Pins: 2; Package Shape: Rectangular; Case/Package: 0402; Terminal Finish: Nickel; Min Operating Temperature: -55°C; Max Operating Temperature: 155°C; Tolerance: 1%; JESD-609 Code: e3; Resistor Type: FIXED RESISTOR; Construction: Chip; Packaging: Tape and Reel; Value: 27R; Technology: METAL GLAZE/THICK FILM; Termination: Wraparound; Reach SVHC Compliant: Yes; RoHS Compliant: Yes; ComponentLink1URL: https://datasheet.ciiva.com:443/pdfs/VipMasterIC/IC/YAGO/YAGO-S-A0003597364/YAGO-S-A0003597364-1.pdf?src-supplier=IHS+Markit; ComponentLink1Description: https://datasheet.ciiva.com:443/pdfs/VipMasterIC/IC/YAGO/YAGO-S-A0003597364/YAGO-S-A0003597364-1.pdf?src-supplier=IHS+Markit; ComponentLink2URL: http://www.yageo.com/NewPortal/yageodocoutput?fileName=/pdf/R-Chip/PYu-AC_51_RoHS_L_5.pdf&src-supplier=Digikey; ComponentLink2Description: http://www.yageo.com/NewPortal/yageodocoutput?fileName=/pdf/R-Chip/PYu-AC_51_RoHS_L_5.pdf&src-supplier=Digikey; ComponentLink3URL: http://www.yageo.com/NewPortal/yageodocoutput?fileName=/pdf/R-Chip/PYu-AC_51_RoHS_L_6.pdf&src-supplier=Digikey; ComponentLink3Description: http://www.yageo.com/NewPortal/yageodocoutput?fileName=/pdf/R-Chip/PYu-AC_51_RoHS_L_6.pdf&src-supplier=Digikey; ComponentLink4URL: https://datasheet.octopart.com/AC0402FR-0727RL-Yageo-datasheet-151884373.pdf?src-supplier=Future+Electronics; ComponentLink4Description: https://datasheet.octopart.com/AC0402FR-0727RL-Yageo-datasheet-151884373.pdf?src-supplier=Future+Electronics; LCSC Part Number: C226392
R?#3 = AC0402FR-074K7L: Manufacturer: Yageo; Tolerance: 1%; Additional Feature: LASER TRIMMABLE; Power: 62.5mW; Rated Temperature: 70°C; Value: 4.7kR; Working Voltage: 50V; Temperature Coefficient (ppm/Cel): 100; Package Height: 0.32mm; Package Length: 1mm; Package Width: 0.5mm; Reference Standard: AEC-Q200; Supplier: Digikey; Supplier Part Number: YAG3497CT-ND; Manufacturer Part Number: AC0402FR-074K7L; RoHS: Yes; Category: Chip SMD Resistors; Stock: 127046; Pricing: 1=0,1, 10=0,011, 100=0,0082, 1000=0,00612, 2500=0,0051, 5000=0,00407 (USD); Mounting Technology: Surface Mount; Pins: 2; Package Shape: Rectangular; Case/Package: 0402; Terminal Finish: Nickel; Min Operating Temperature: -55°C; Max Operating Temperature: 155°C; JESD-609 Code: e3; Resistor Type: FIXED RESISTOR; Construction: Chip; Packaging: Tape and Reel; Technology: METAL GLAZE/THICK FILM; Termination: Wraparound; Reach SVHC Compliant: Yes; RoHS Compliant: Yes; ComponentLink1URL: https://datasheet.ciiva.com:443/pdfs/VipMasterIC/IC/YAGO/YAGO-S-A0003597364/YAGO-S-A0003597364-1.pdf?src-supplier=IHS+Markit; ComponentLink1Description: https://datasheet.ciiva.com:443/pdfs/VipMasterIC/IC/YAGO/YAGO-S-A0003597364/YAGO-S-A0003597364-1.pdf?src-supplier=IHS+Markit; ComponentLink2URL: http://www.mouser.com/ds/2/447/yageodocoutput-1111992.pdf?src-supplier=Mouser; ComponentLink2Description: http://www.mouser.com/ds/2/447/yageodocoutput-1111992.pdf?src-supplier=Mouser; ComponentLink3URL: http://www.yageo.com/NewPortal/yageodocoutput?fileName=/pdf/R-Chip/PYu-AC_51_RoHS_L_6.pdf&src-supplier=Digikey; ComponentLink3Description: http://www.yageo.com/NewPortal/yageodocoutput?fileName=/pdf/R-Chip/PYu-AC_51_RoHS_L_6.pdf&src-supplier=Digikey; ComponentLink4URL: http://www.yageo.com/documents/recent/PYu-AC_51_RoHS_L_2_revised.pdf?src-supplier=Future+Electronics; ComponentLink4Description: http://www.yageo.com/documents/recent/PYu-AC_51_RoHS_L_2_revised.pdf?src-supplier=Future+Electronics; LCSC Part Number: C174364
R?#4 R?#10 = RC0402JR-070RL: RES 0 OHM JUMPER 1/16W 0402; Manufacturer: Yageo; Power: 62.5mW; Rated Temperature: 70°C; Package Height: 0.35mm; Package Length: 1mm; Package Width: 0.5mm; Supplier: Digikey; Supplier Part Number: 311-0.0JRCT-ND; Manufacturer Part Number: RC0402JR-070RL; RoHS: Yes; Category: Chip SMD Resistors; Stock: 1886568; Pricing: 1=0,1, 10=0,01, 25=0,0064, 50=0,0054, 100=0,0047, 250=0,00392, 500=0,00346, 1000=0,00304, 5000=0,0023 (USD); Mounting Technology: Surface Mount; Pins: 2; Package Shape: Rectangular; Case/Package: 0402; Terminal Finish: Nickel; Min Operating Temperature: -55°C; Max Operating Temperature: 155°C; JESD-609 Code: e3; Resistor Type: FIXED RESISTOR; Packaging: Tape and Reel; Value: 0R; Technology: METAL GLAZE/THICK FILM; Termination: Wraparound; Construction: Chip; Reach SVHC Compliant: Yes; RoHS Compliant: Yes; ComponentLink1URL: https://datasheet.ciiva.com:443/pdfs/VipMasterIC/IC/YAGO/YAGO-S-A0008145938/YAGO-S-A0008145938-1.pdf?src-supplier=IHS+Markit; ComponentLink1Description: https://datasheet.ciiva.com:443/pdfs/VipMasterIC/IC/YAGO/YAGO-S-A0008145938/YAGO-S-A0008145938-1.pdf?src-supplier=IHS+Markit; LCSC Part Number: C60485
R?#5 R?#6 R?#13 R?#14 = AC0402FR-075K1L: RES SMD 5.1K OHM 1% 1/16W 0402; Manufacturer: Yageo; Additional Feature: LASER TRIMMABLE; Power: 62.5mW; Rated Temperature: 70°C; Value: 5.1kR; Working Voltage: 50V; Temperature Coefficient (ppm/Cel): 100; Package Height: 0.32mm; Package Length: 1mm; Package Width: 0.5mm; Reference Standard: AEC-Q200; Supplier: Digikey; Supplier Part Number: YAG3503CT-ND; Manufacturer Part Number: AC0402FR-075K1L; RoHS: Yes; Category: Chip SMD Resistors; Stock: 58891; Pricing: 1=0,1, 10=0,009, 100=0,0071, 1000=0,00612, 2500=0,0051, 5000=0,00407, 10000=0,00204 (USD); Mounting Technology: Surface Mount; Pins: 2; Package Shape: Rectangular; Case/Package: 0402; Terminal Finish: Nickel; Min Operating Temperature: -55°C; Max Operating Temperature: 155°C; Tolerance: 1%; JESD-609 Code: e3; Resistor Type: FIXED RESISTOR; Construction: Chip; Packaging: Tape and Reel; Technology: METAL GLAZE/THICK FILM; Termination: Wraparound; Reach SVHC Compliant: Yes; RoHS Compliant: Yes; ComponentLink1URL: https://datasheet.ciiva.com:443/pdfs/VipMasterIC/IC/YAGO/YAGO-S-A0003597364/YAGO-S-A0003597364-1.pdf?src-supplier=IHS+Markit; ComponentLink1Description: https://datasheet.ciiva.com:443/pdfs/VipMasterIC/IC/YAGO/YAGO-S-A0003597364/YAGO-S-A0003597364-1.pdf?src-supplier=IHS+Markit; ComponentLink2URL: https://datasheet.octopart.com/AC0402FR-075K1L-Yageo-datasheet-166720450.pdf?src-supplier=Future+Electronics; ComponentLink2Description: https://datasheet.octopart.com/AC0402FR-075K1L-Yageo-datasheet-166720450.pdf?src-supplier=Future+Electronics; ComponentLink3URL: http://www.yageo.com/documents/recent/PYu-AC_51_RoHS_L_2_revised.pdf?src-supplier=Future+Electronics; ComponentLink3Description: http://www.yageo.com/documents/recent/PYu-AC_51_RoHS_L_2_revised.pdf?src-supplier=Future+Electronics; ComponentLink4URL: http://www.yageo.com/NewPortal/yageodocoutput?fileName=/pdf/R-Chip/PYu-AC_51_RoHS_L_6.pdf&src-supplier=Digikey; ComponentLink4Description: http://www.yageo.com/NewPortal/yageodocoutput?fileName=/pdf/R-Chip/PYu-AC_51_RoHS_L_6.pdf&src-supplier=Digikey; LCSC Part Number: C144745
R?#7-R?#9 R?#15 = AC0402FR-0710KL: RES SMD 10K OHM 1% 1/16W 0402; Manufacturer: Yageo; Additional Feature: LASER TRIMMABLE; Power: 62.5mW; Rated Temperature: 70°C; Value: 10kR; Working Voltage: 50V; Temperature Coefficient (ppm/Cel): 100; Package Height: 0.32mm; Package Length: 1mm; Package Width: 0.5mm; Reference Standard: AEC-Q200; Supplier: Digikey; Supplier Part Number: YAG3436CT-ND; Manufacturer Part Number: AC0402FR-0710KL; RoHS: Yes; Category: Chip SMD Resistors; Stock: 269638; Pricing: 1=0,1, 10=0,009, 100=0,0082, 1000=0,00612, 2500=0,0051, 5000=0,00407 (USD); Mounting Technology: Surface Mount; Pins: 2; Package Shape: Rectangular; Case/Package: 0402; Terminal Finish: Nickel; Min Operating Temperature: -55°C; Max Operating Temperature: 155°C; Tolerance: 1%; JESD-609 Code: e3; Resistor Type: FIXED RESISTOR; Construction: Chip; Packaging: Tape and Reel; Technology: METAL GLAZE/THICK FILM; Termination: Wraparound; Reach SVHC Compliant: Yes; RoHS Compliant: Yes; ComponentLink1URL: https://datasheet.ciiva.com:443/pdfs/VipMasterIC/IC/YAGO/YAGO-S-A0003597364/YAGO-S-A0003597364-1.pdf?src-supplier=IHS+Markit; ComponentLink1Description: https://datasheet.ciiva.com:443/pdfs/VipMasterIC/IC/YAGO/YAGO-S-A0003597364/YAGO-S-A0003597364-1.pdf?src-supplier=IHS+Markit; ComponentLink2URL: https://datasheet.ciiva.com/12656/pyu-ac-51-rohs-l-2-12656634.pdf?src-supplier=Mouser; ComponentLink2Description: https://datasheet.ciiva.com/12656/pyu-ac-51-rohs-l-2-12656634.pdf?src-supplier=Mouser; LCSC Part Number: C144807
R?#11 R?#12 = AC0402JR-071KL: RES SMD 1K OHM 5% 1/16W 0402; Manufacturer: Yageo; Additional Feature: LASER TRIMMABLE; Power: 62.5mW; Rated Temperature: 70°C; Value: 1kR; Working Voltage: 50V; Temperature Coefficient (ppm/Cel): 100; Package Height: 0.32mm; Package Length: 1mm; Package Width: 0.5mm; Reference Standard: AEC-Q200; Supplier: Digikey; Supplier Part Number: YAG3525CT-ND; Manufacturer Part Number: AC0402JR-071KL; RoHS: Yes; Category: Chip SMD Resistors; Stock: 135341; Pricing: 1=0,1, 10=0,007, 50=0,0066, 100=0,0061, 500=0,0051, 1000=0,00408 (USD); Mounting Technology: Surface Mount; Pins: 2; Package Shape: Rectangular; Case/Package: 0402; Terminal Finish: Nickel; Min Operating Temperature: -55°C; Max Operating Temperature: 155°C; Tolerance: 5%; JESD-609 Code: e3; Termination: Wraparound; Resistor Type: FIXED RESISTOR; Construction: Chip; Packaging: Tape and Reel; Technology: METAL GLAZE/THICK FILM; Reach SVHC Compliant: Yes; RoHS Compliant: Yes; ComponentLink1URL: https://datasheet.ciiva.com:443/pdfs/VipMasterIC/IC/YAGO/YAGO-S-A0003597364/YAGO-S-A0003597364-1.pdf?src-supplier=IHS+Markit; ComponentLink1Description: https://datasheet.ciiva.com:443/pdfs/VipMasterIC/IC/YAGO/YAGO-S-A0003597364/YAGO-S-A0003597364-1.pdf?src-supplier=IHS+Markit; ComponentLink2URL: https://datasheet.ciiva.com/12577/pyu-ac-51-rohs-l-2-12577195.pdf?src-supplier=Mouser; ComponentLink2Description: https://datasheet.ciiva.com/12577/pyu-ac-51-rohs-l-2-12577195.pdf?src-supplier=Mouser; LCSC Part Number: C138287
SW?#1 SW?#2 = PTS645SH50SMTR92LFS: SWITCH TACTILE SPST-NO 0.05A 12V; Manufacturer: ITT C&K; Manufacturer Series: PTS645; Contact Current(DC)-Max: 50mA; Contact DC Max Rating R Load: 0.05A@12VDC; Switch Action: MOMENTARY; Switch Function: SPST; Switch Type: Keypad; Actuator Type: Pushbutton; Contact Resistance: 0.1mR; Dielectric Withstand Volts: 250VACV; Insulation Resistance: 100GR; PCB Hole Count: 4; Body Breadth: 5.9944mm; Body Height: 3.4544mm; Supplier: Digikey; Supplier Part Number: CKN9085CT-ND; Manufacturer Part Number: PTS645SH50SMTR92LFS; RoHS: Yes; Category: Tactile Switches; Stock: 14865; Pricing: 1=0,33, 10=0,285, 25=0,2692, 100=0,2476, 250=0,23404, 500=0,22418 (USD); Mounting Technology: Surface Mount; Terminal Finish: Silver; Min Operating Temperature: -20°C; Max Operating Temperature: 60°C; JESD-609 Code: e4; Contact Voltage(DC)-Max: 12V; Termination: Solder; Body Length or Diameter: 5.9944mm; Terminal Length: 0.138inch; Reach SVHC Compliant: Yes; RoHS Compliant: Yes; ComponentLink1URL: https://datasheet.ciiva.com:443/pdfs/VipMasterIC/IC/CKCI/CKCI-S-A0001796527/CKCI-S-A0001796842-1.pdf?src-supplier=IHS+Markit; ComponentLink1Description: https://datasheet.ciiva.com:443/pdfs/VipMasterIC/IC/CKCI/CKCI-S-A0001796527/CKCI-S-A0001796842-1.pdf?src-supplier=IHS+Markit; ComponentLink2URL: https://datasheet.ciiva.com/29903/getdatasheetpartid-773702-29903807.pdf?src-supplier=Verical; ComponentLink2Description: https://datasheet.ciiva.com/29903/getdatasheetpartid-773702-29903807.pdf?src-supplier=Verical; ComponentLink3URL: https://datasheet.ciiva.com/14920/pts645-14920741.pdf?src-supplier=Digikey; ComponentLink3Description: https://datasheet.ciiva.com/14920/pts645-14920741.pdf?src-supplier=Digikey; ComponentLink4URL: https://datasheet.ciiva.com/22637/1707731-22637356.pdf?src-supplier=Element14; ComponentLink4Description: https://datasheet.ciiva.com/22637/1707731-22637356.pdf?src-supplier=Element14; LCSC Part Number: C221869
U? = FT231XQ-R: IC USB SERIAL FULL UART 20QFN; Manufacturer: FTDI; Power Supplies: 3.3/5V; Max Supply Current: 8.4mA; Max Supply Voltage: 5.5V; Min Supply Voltage: 2.97V; Nominal Supply Voltage: 5V; Qualification Status: Not Qualified; Supplier: Digikey; Supplier Part Number: 768-1128-1-ND; Manufacturer Part Number: FT231XQ-R; RoHS: Yes; Category: Interface ICs; Stock: 35376; Pricing: 1=2,34, 25=2,27, 100=2,2, 250=2, 500=1,82002, 1000=1,7625 (USD); Case/Package: HVQCCN; Pins: 20; Package Shape: Square; Min Operating Temperature: -40°C; Max Operating Temperature: 85°C; JESD-30 Code: S-XQCC-N20; Package Style: CHIP CARRIER, HEAT SINK/SLUG, VERY THIN PROFILEMeter; Surface Mount: Yes; Technology: CMOS; Terminal Form: No Lead; Terminal Position: QUAD; Length: 4mm; Width: 4mm; Height - Seated (Max): 0.8mm; Terminal Pitch: 0.5mm; Temperature Grade: INDUSTRIAL; Reach SVHC Compliant: Yes; RoHS Compliant: Yes; ComponentLink1URL: https://datasheet.ciiva.com:443/pdfs/VipMasterIC/IC/FTDI/FTDIS00099/FTDIS00099-1.pdf?src-supplier=IHS+Markit; ComponentLink1Description: https://datasheet.ciiva.com:443/pdfs/VipMasterIC/IC/FTDI/FTDIS00099/FTDIS00099-1.pdf?src-supplier=IHS+Markit; ComponentLink2URL: https://datasheet.ciiva.com/1787/ds-ft231x-1787312.pdf?src-supplier=Digikey; ComponentLink2Description: https://datasheet.ciiva.com/1787/ds-ft231x-1787312.pdf?src-supplier=Digikey; ComponentLink3URL: https://datasheet.ciiva.com/4787/ds-ft231x-13571-4787570.pdf?src-supplier=Mouser; ComponentLink3Description: https://datasheet.ciiva.com/4787/ds-ft231x-13571-4787570.pdf?src-supplier=Mouser; ComponentLink4URL: https://datasheet.ciiva.com/30475/0900766b811020d3-30475405.pdf?src-supplier=Rs; ComponentLink4Description: https://datasheet.ciiva.com/30475/0900766b811020d3-30475405.pdf?src-supplier=Rs; ComponentLink5URL: https://datasheet.ciiva.com/1787/ft-x-series-1787313.pdf?src-supplier=Digikey; ComponentLink5Description: https://datasheet.ciiva.com/1787/ft-x-series-1787313.pdf?src-supplier=Digikey; ComponentLink6URL: https://datasheet.ciiva.com/1787/ft-x-series-1787314.pdf?src-supplier=Digikey; ComponentLink6Description: https://datasheet.ciiva.com/1787/ft-x-series-1787314.pdf?src-supplier=Digikey; LCSC Part Number: C132159